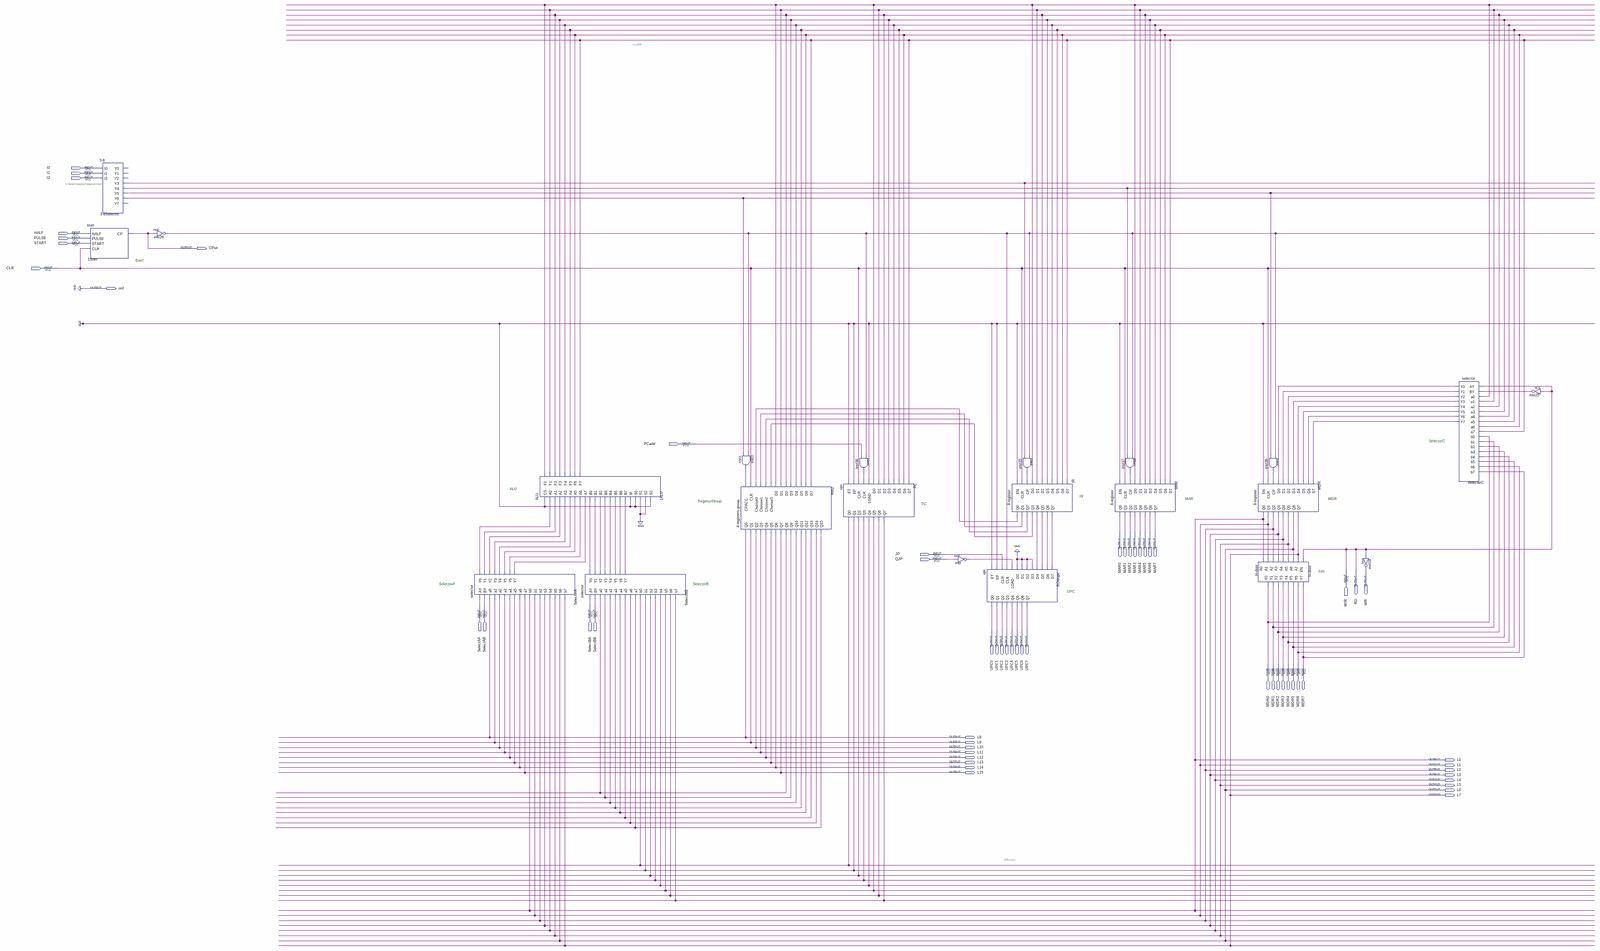
[diagram p0: schematic sheet, whole]
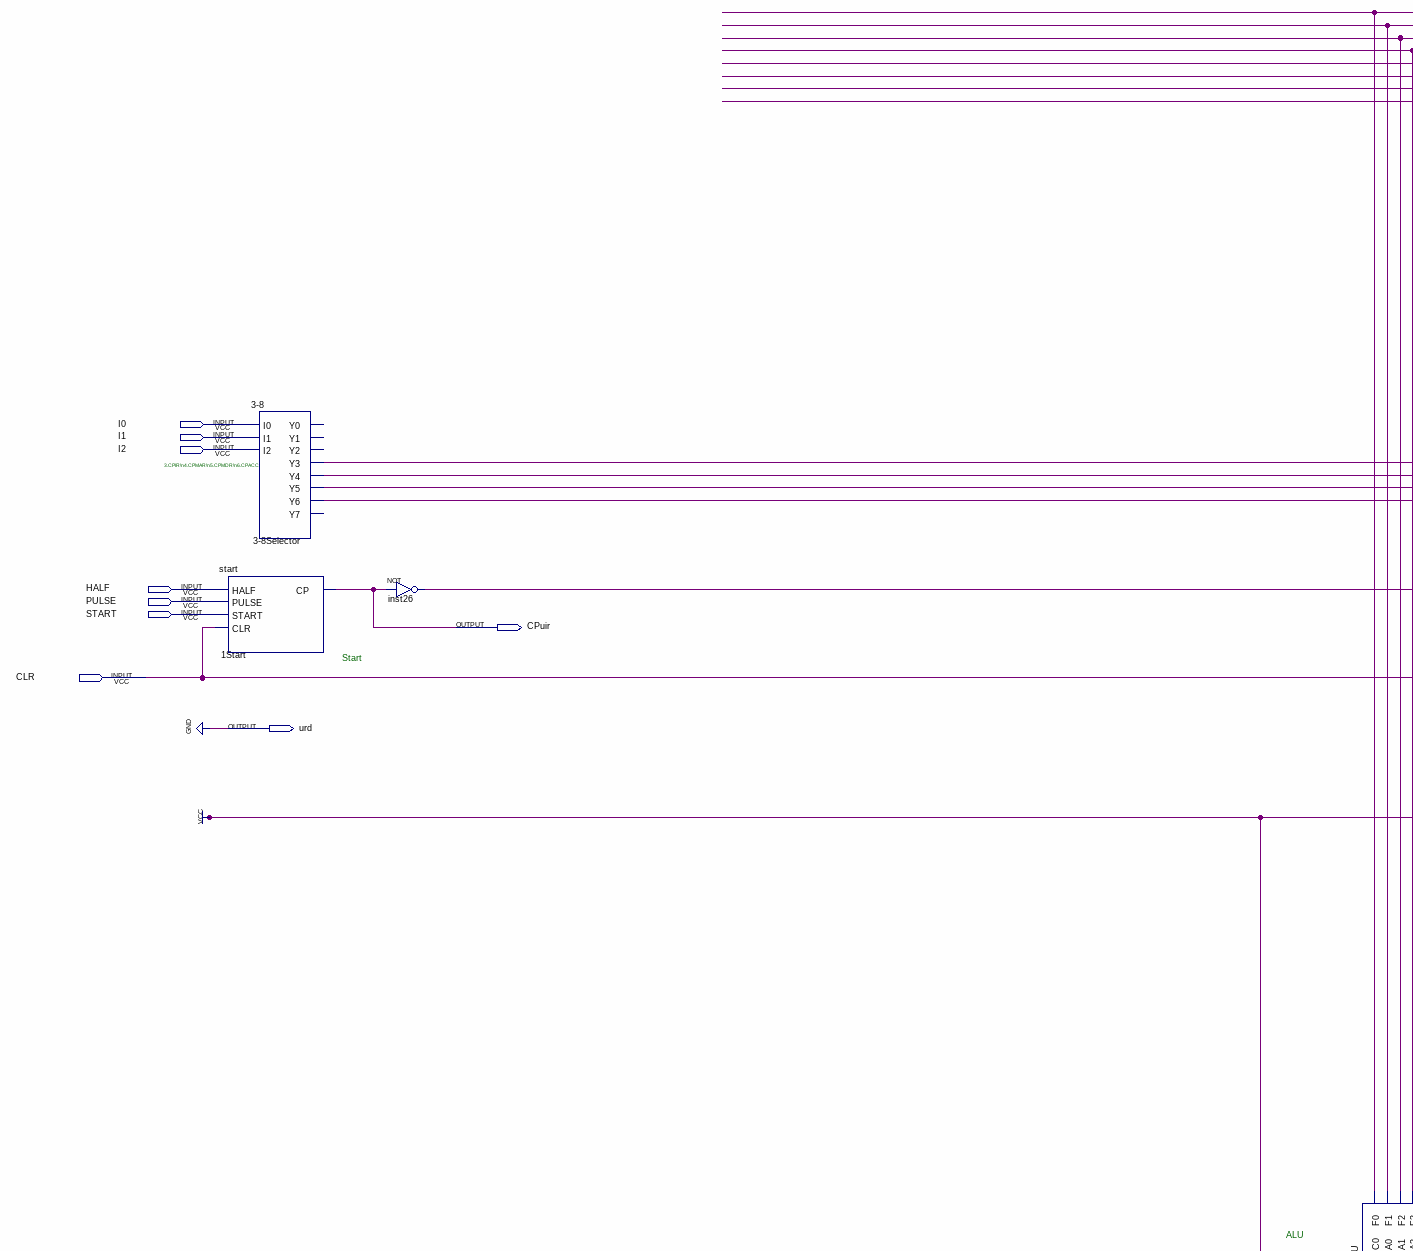
[diagram p1: schematic sheet, upper left part]
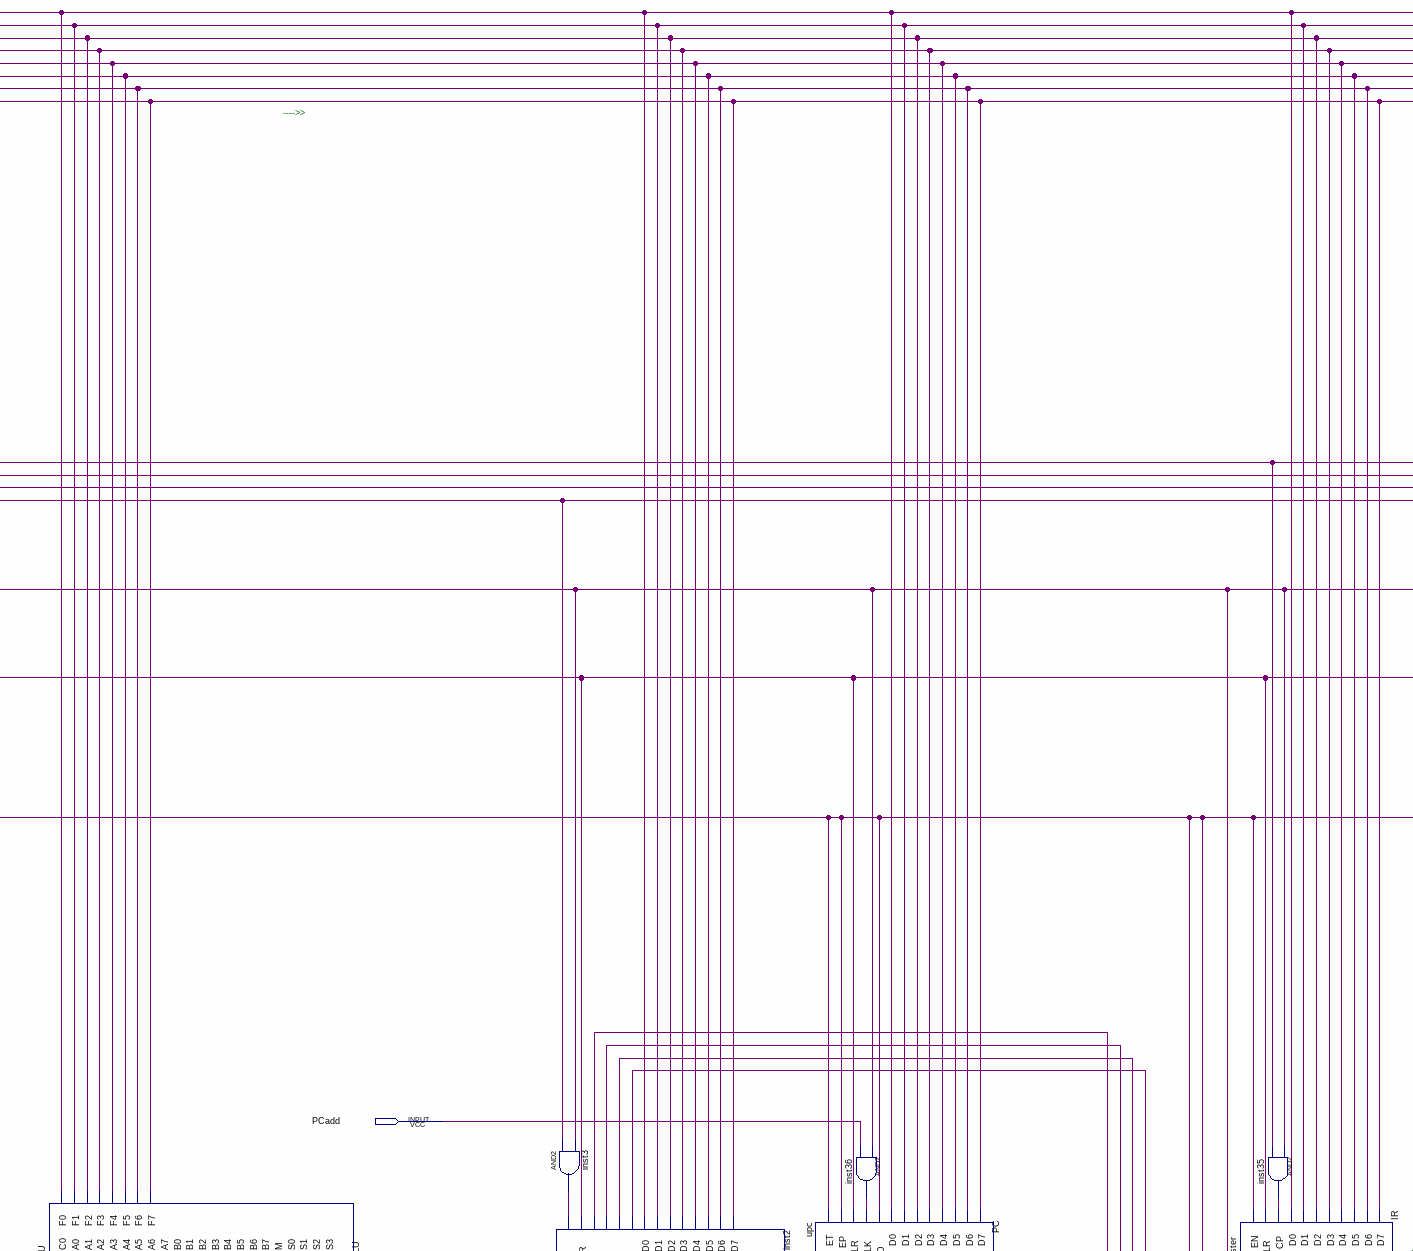
[diagram p2: schematic sheet, upper centre part]
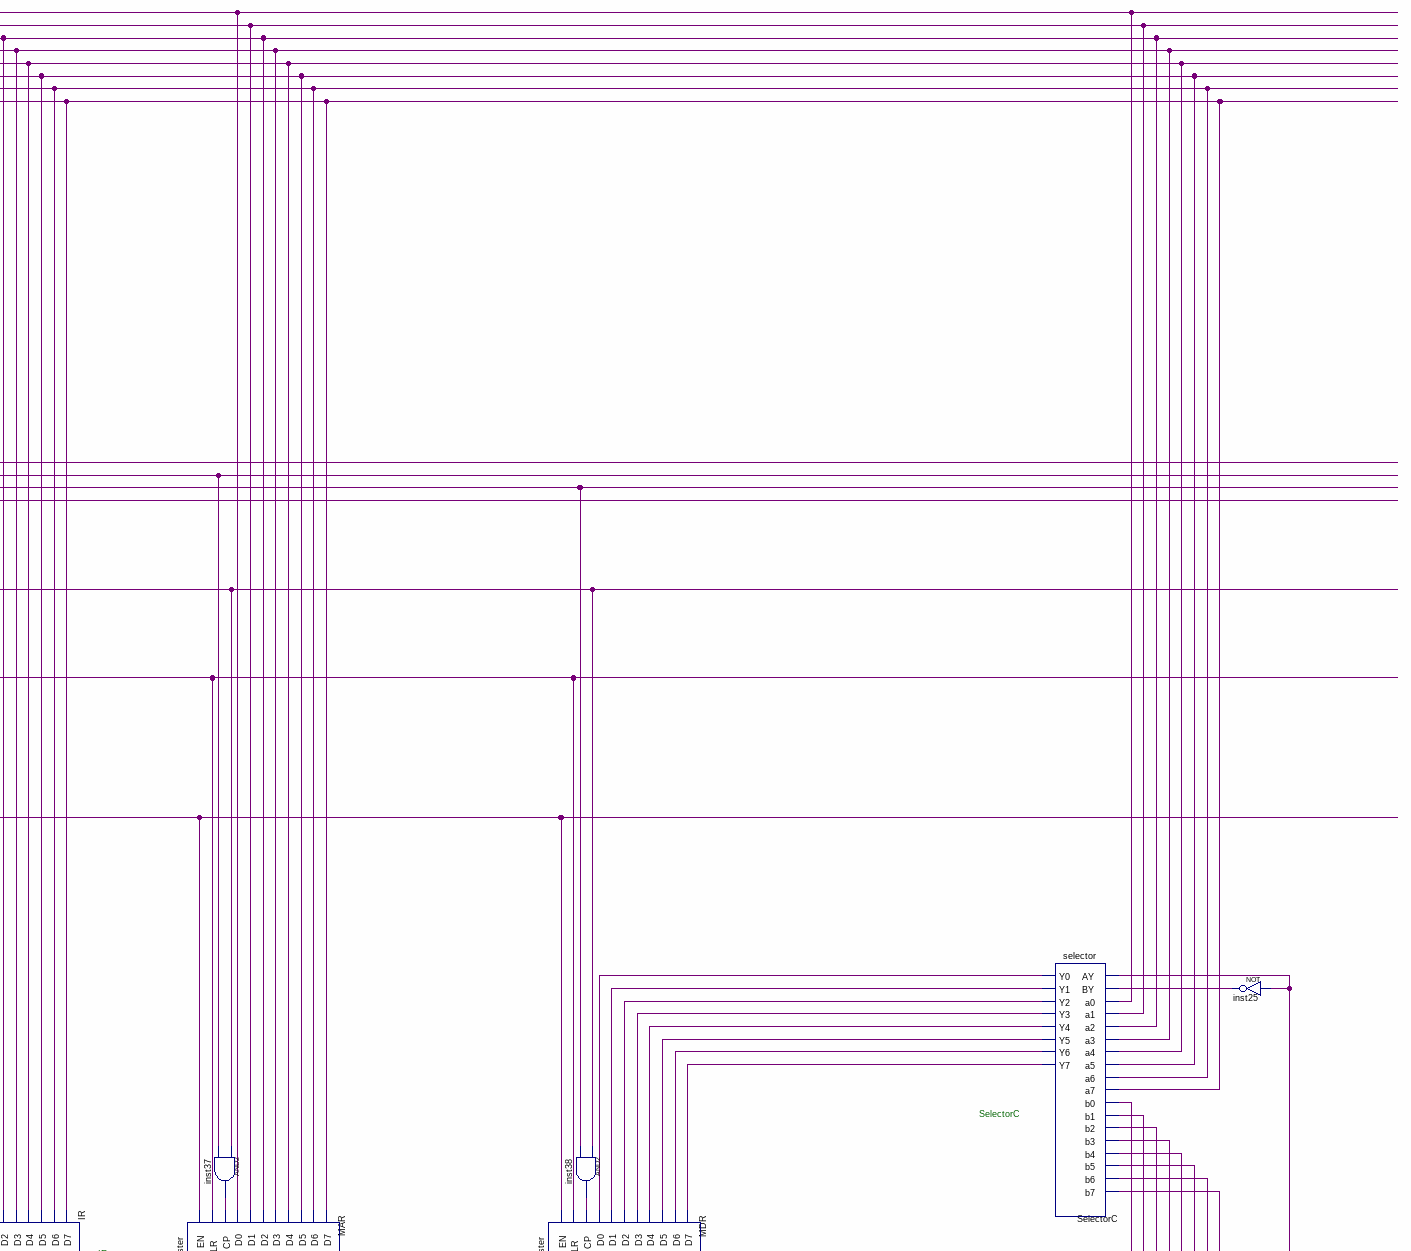
[diagram p3: schematic sheet, upper right part]
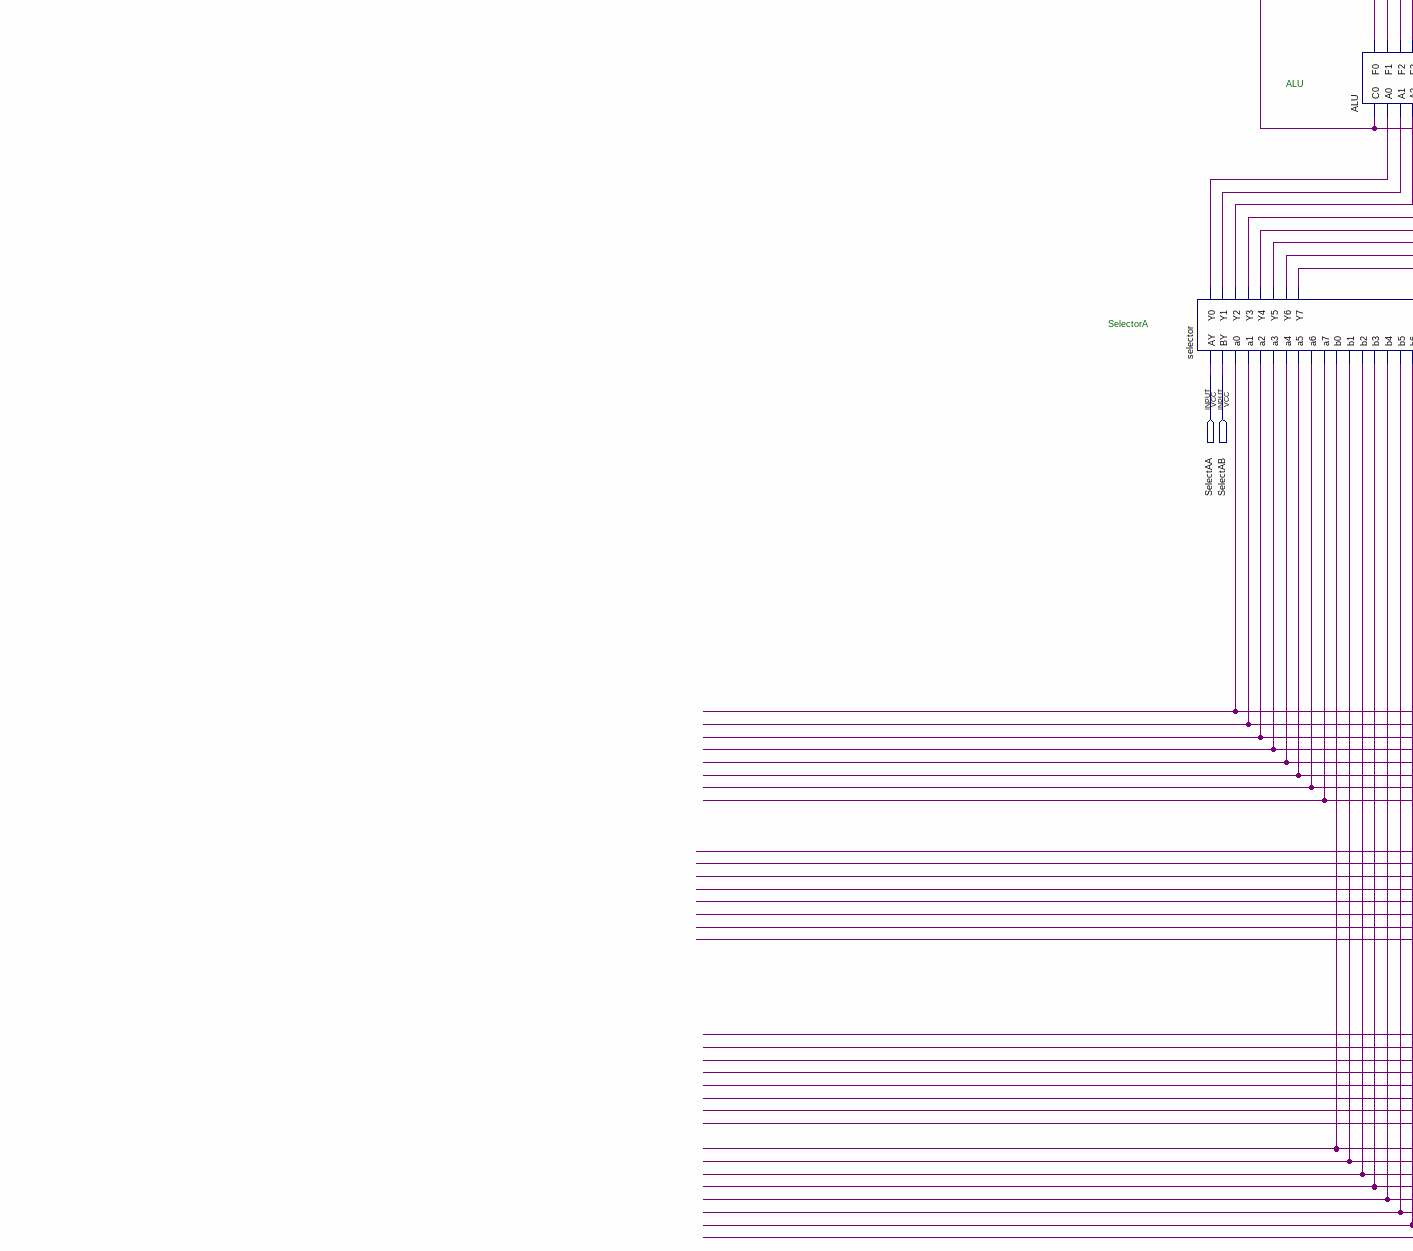
[diagram p4: schematic sheet, lower left part]
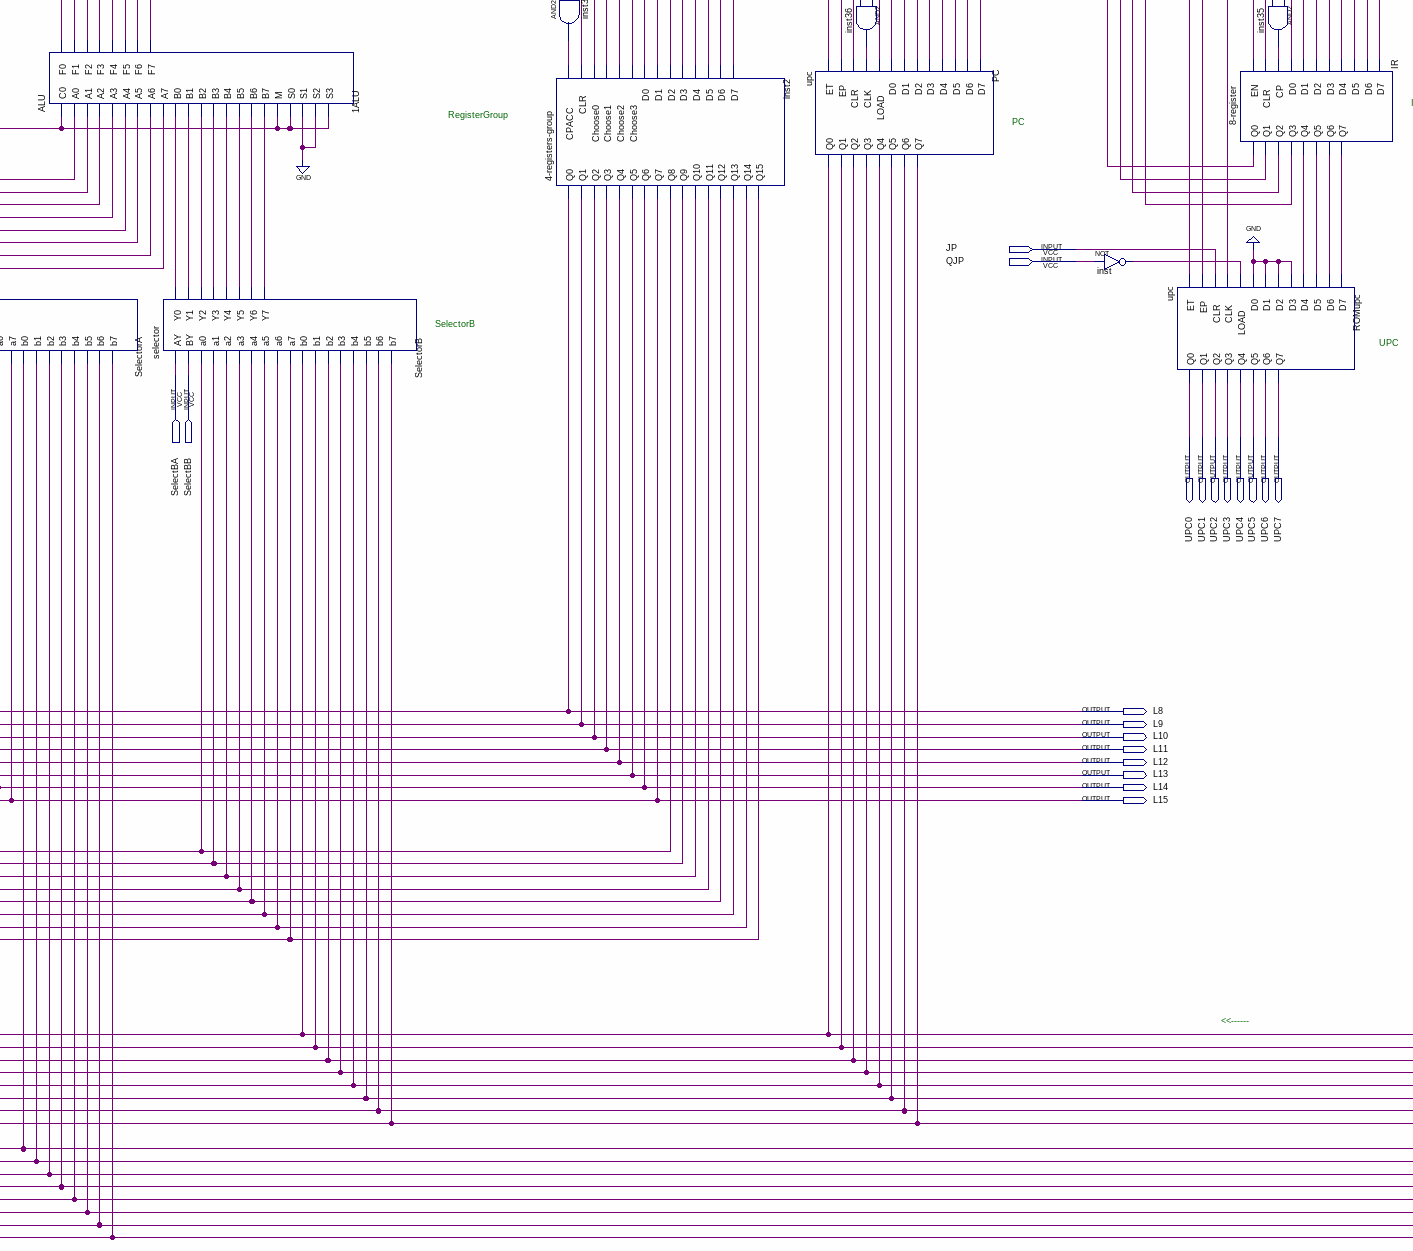
[diagram p5: schematic sheet, lower centre part]
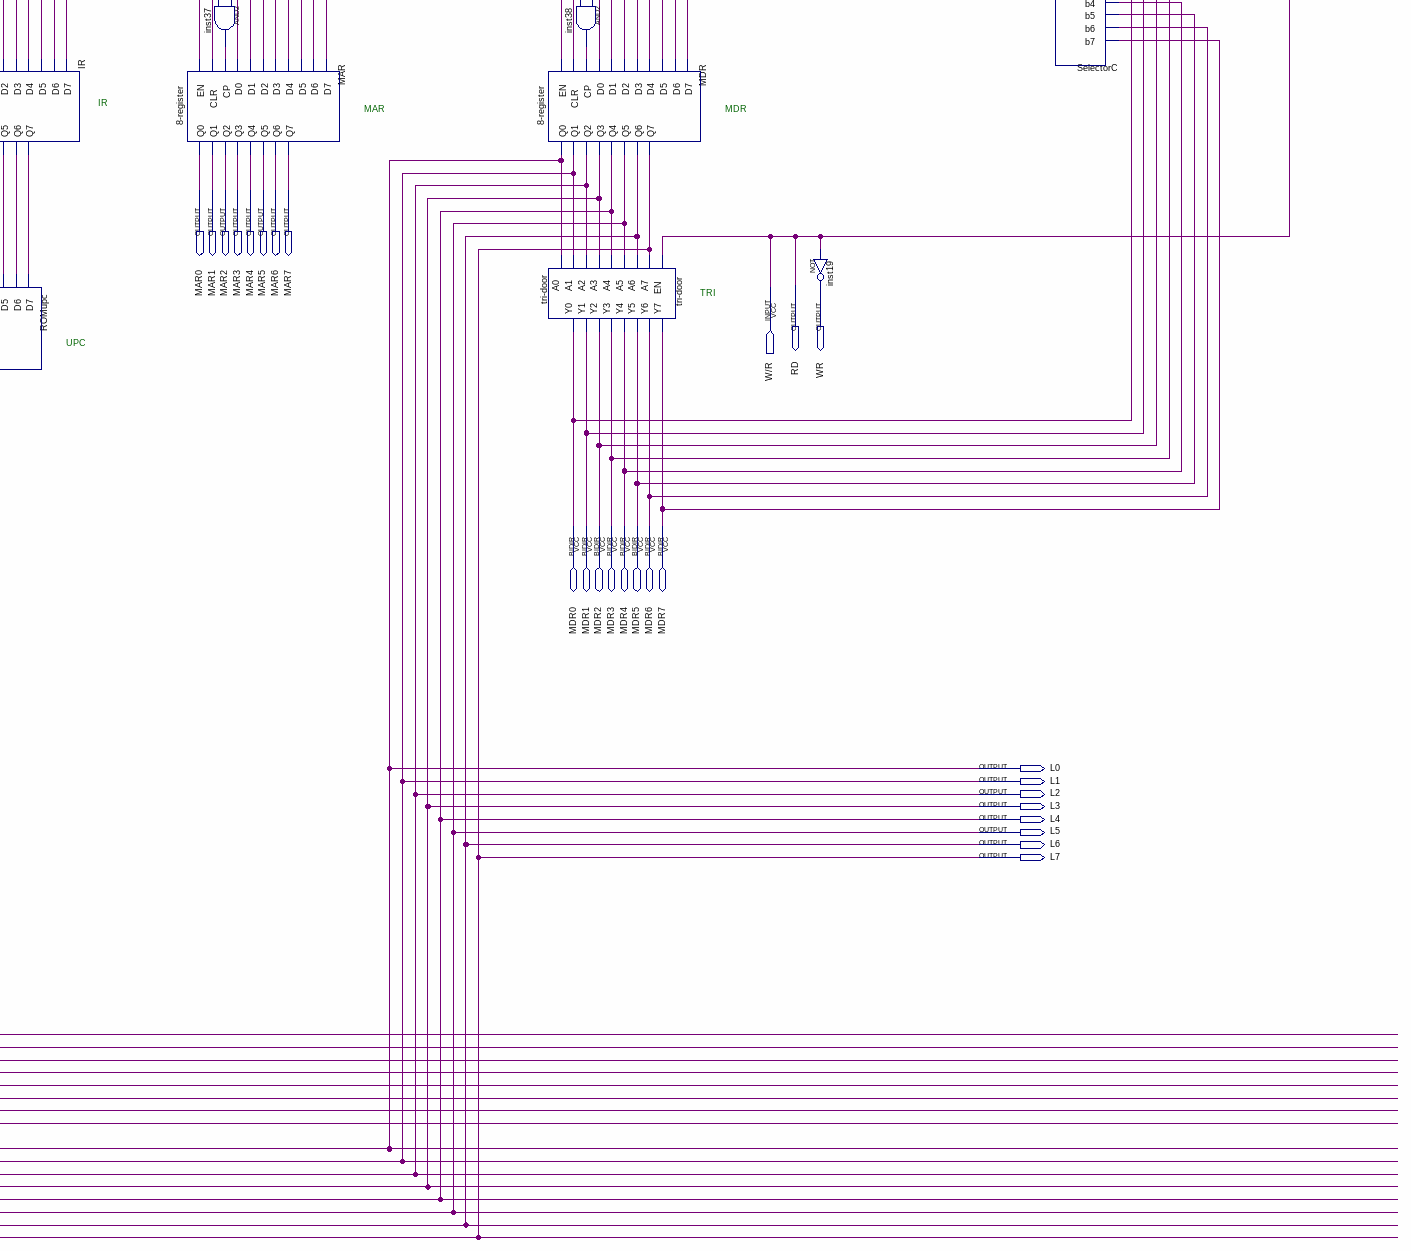
[diagram p6: schematic sheet, lower right part]
// Quartus schematic computer.bdf as structural Verilog: 22 symbols, 59 pins
module computer (
  input  I0,
  input  I1,
  input  I2,
  input  HALF,
  input  PULSE,
  input  START,
  input  CLR,
  input  PCadd,
  input  JP,
  input  QJP,
  input  \W/R ,
  input  SelectAA,
  input  SelectAB,
  input  SelectBA,
  input  SelectBB,
  inout  MDR0,
  inout  MDR1,
  inout  MDR2,
  inout  MDR3,
  inout  MDR4,
  inout  MDR5,
  inout  MDR6,
  inout  MDR7,
  output CPuir,
  output urd,
  output MAR0,
  output MAR1,
  output MAR2,
  output MAR3,
  output MAR4,
  output MAR5,
  output MAR6,
  output MAR7,
  output RD,
  output WR,
  output UPC0,
  output UPC1,
  output UPC2,
  output UPC3,
  output UPC4,
  output UPC5,
  output UPC6,
  output UPC7,
  output L8,
  output L9,
  output L10,
  output L11,
  output L12,
  output L0,
  output L13,
  output L1,
  output L14,
  output L2,
  output L15,
  output L3,
  output L4,
  output L5,
  output L6,
  output L7
);

  wire inst2_q8, inst2_q9, inst2_q10, inst2_q11, inst2_q12, inst2_q13, inst2_q14, inst2_q15, inst3_out,
       inst25_out, inst26_out, inst35_out, inst36_out, inst37_out, inst38_out, inst_out, IR_q0, IR_q1, IR_q2,
       IR_q3, IR_q4, IR_q5, IR_q6, IR_q7, n1ALU_f0, n1ALU_f1, n1ALU_f2, n1ALU_f3, n1ALU_f4, n1ALU_f5,
       n1ALU_f6, n1ALU_f7, n3_8Selector_y3, n3_8Selector_y4, n3_8Selector_y5, n3_8Selector_y6, PC_q0, PC_q1,
       PC_q2, PC_q3, PC_q4, PC_q5, PC_q6, PC_q7, SelectorA_y0, SelectorA_y1, SelectorA_y2, SelectorA_y3,
       SelectorA_y4, SelectorA_y5, SelectorA_y6, SelectorA_y7, SelectorB_y0, SelectorB_y1, SelectorB_y2,
       SelectorB_y3, SelectorB_y4, SelectorB_y5, SelectorB_y6, SelectorB_y7, SelectorC_y0, SelectorC_y1,
       SelectorC_y2, SelectorC_y3, SelectorC_y4, SelectorC_y5, SelectorC_y6, SelectorC_y7;

  start u_1Start (.HALF(HALF), .PULSE(PULSE), .START(START), .CLR(CLR), .CP(CPuir));
  \3-8  \u_3-8Selector  (
    .I0(I0), .I1(I1), .I2(I2), .Y3(n3_8Selector_y3), .Y4(n3_8Selector_y4), .Y5(n3_8Selector_y5),
    .Y6(n3_8Selector_y6));  // open: Y0, Y1, Y2, Y7
  not inst26 (inst26_out, CPuir);
  selector SelectorA (
    .AY(SelectAA), .BY(SelectAB), .a0(L8), .a1(L9), .a2(L10), .a3(L11), .a4(L12), .a5(L13), .a6(L14),
    .a7(L15), .b0(L0), .b1(L1), .b2(L2), .b3(L3), .b4(L4), .b5(L5), .b6(L6), .b7(L7), .Y0(SelectorA_y0),
    .Y1(SelectorA_y1), .Y2(SelectorA_y2), .Y3(SelectorA_y3), .Y4(SelectorA_y4), .Y5(SelectorA_y5),
    .Y6(SelectorA_y6), .Y7(SelectorA_y7));
  ALU u_1ALU (
    .C0(1'b1), .A0(SelectorA_y0), .A1(SelectorA_y1), .A2(SelectorA_y2), .A3(SelectorA_y3), .A4(SelectorA_y4),
    .A5(SelectorA_y5), .A6(SelectorA_y6), .A7(SelectorA_y7), .B0(SelectorB_y0), .B1(SelectorB_y1),
    .B2(SelectorB_y2), .B3(SelectorB_y3), .B4(SelectorB_y4), .B5(SelectorB_y5), .B6(SelectorB_y6),
    .B7(SelectorB_y7), .M(1'b1), .S0(1'b1), .S1(1'b0), .S2(1'b0), .S3(1'b1), .F0(n1ALU_f0), .F1(n1ALU_f1),
    .F2(n1ALU_f2), .F3(n1ALU_f3), .F4(n1ALU_f4), .F5(n1ALU_f5), .F6(n1ALU_f6), .F7(n1ALU_f7));
  selector SelectorB (
    .AY(SelectBA), .BY(SelectBB), .a0(inst2_q8), .a1(inst2_q9), .a2(inst2_q10), .a3(inst2_q11),
    .a4(inst2_q12), .a5(inst2_q13), .a6(inst2_q14), .a7(inst2_q15), .b0(PC_q0), .b1(PC_q1), .b2(PC_q2),
    .b3(PC_q3), .b4(PC_q4), .b5(PC_q5), .b6(PC_q6), .b7(PC_q7), .Y0(SelectorB_y0), .Y1(SelectorB_y1),
    .Y2(SelectorB_y2), .Y3(SelectorB_y3), .Y4(SelectorB_y4), .Y5(SelectorB_y5), .Y6(SelectorB_y6),
    .Y7(SelectorB_y7));
  and inst3 (inst3_out, n3_8Selector_y6, inst26_out);
  \4-registers-group  inst2 (
    .CPACC(inst3_out), .CLR(CLR), .Choose0(IR_q0), .Choose1(IR_q1), .Choose2(IR_q2), .Choose3(IR_q3),
    .D0(n1ALU_f0), .D1(n1ALU_f1), .D2(n1ALU_f2), .D3(n1ALU_f3), .D4(n1ALU_f4), .D5(n1ALU_f5), .D6(n1ALU_f6),
    .D7(n1ALU_f7), .Q0(L8), .Q1(L9), .Q2(L10), .Q3(L11), .Q4(L12), .Q5(L13), .Q6(L14), .Q7(L15),
    .Q8(inst2_q8), .Q9(inst2_q9), .Q10(inst2_q10), .Q11(inst2_q11), .Q12(inst2_q12), .Q13(inst2_q13),
    .Q14(inst2_q14), .Q15(inst2_q15));
  upc PC (
    .ET(1'b1), .EP(1'b1), .CLR(CLR), .CLK(inst36_out), .LOAD(1'b1), .D0(n1ALU_f0), .D1(n1ALU_f1),
    .D2(n1ALU_f2), .D3(n1ALU_f3), .D4(n1ALU_f4), .D5(n1ALU_f5), .D6(n1ALU_f6), .D7(n1ALU_f7), .Q0(PC_q0),
    .Q1(PC_q1), .Q2(PC_q2), .Q3(PC_q3), .Q4(PC_q4), .Q5(PC_q5), .Q6(PC_q6), .Q7(PC_q7));
  and inst36 (inst36_out, inst26_out, PCadd);
  not inst (inst_out, QJP);
  upc ROMupc (
    .ET(1'b1), .EP(1'b1), .CLR(JP), .CLK(inst26_out), .LOAD(inst_out), .D0(1'b0), .D1(1'b0), .D2(1'b0),
    .D3(1'b0), .D4(IR_q4), .D5(IR_q5), .D6(IR_q6), .D7(IR_q7), .Q0(UPC0), .Q1(UPC1), .Q2(UPC2), .Q3(UPC3),
    .Q4(UPC4), .Q5(UPC5), .Q6(UPC6), .Q7(UPC7));
  \8-register  IR (
    .EN(1'b1), .CLR(CLR), .CP(inst35_out), .D0(n1ALU_f0), .D1(n1ALU_f1), .D2(n1ALU_f2), .D3(n1ALU_f3),
    .D4(n1ALU_f4), .D5(n1ALU_f5), .D6(n1ALU_f6), .D7(n1ALU_f7), .Q0(IR_q0), .Q1(IR_q1), .Q2(IR_q2),
    .Q3(IR_q3), .Q4(IR_q4), .Q5(IR_q5), .Q6(IR_q6), .Q7(IR_q7));
  and inst35 (inst35_out, inst26_out, n3_8Selector_y3);
  \8-register  MAR (
    .EN(1'b1), .CLR(CLR), .CP(inst37_out), .D0(n1ALU_f0), .D1(n1ALU_f1), .D2(n1ALU_f2), .D3(n1ALU_f3),
    .D4(n1ALU_f4), .D5(n1ALU_f5), .D6(n1ALU_f6), .D7(n1ALU_f7), .Q0(MAR0), .Q1(MAR1), .Q2(MAR2), .Q3(MAR3),
    .Q4(MAR4), .Q5(MAR5), .Q6(MAR6), .Q7(MAR7));
  and inst37 (inst37_out, inst26_out, n3_8Selector_y4);
  and inst38 (inst38_out, inst26_out, n3_8Selector_y5);
  \8-register  MDR (
    .EN(1'b1), .CLR(CLR), .CP(inst38_out), .D0(SelectorC_y0), .D1(SelectorC_y1), .D2(SelectorC_y2),
    .D3(SelectorC_y3), .D4(SelectorC_y4), .D5(SelectorC_y5), .D6(SelectorC_y6), .D7(SelectorC_y7), .Q0(L0),
    .Q1(L1), .Q2(L2), .Q3(L3), .Q4(L4), .Q5(L5), .Q6(L6), .Q7(L7));
  \tri-door  \tri-door  (
    .EN(\W/R ), .A7(L7), .A6(L6), .A5(L5), .A4(L4), .A3(L3), .A2(L2), .A1(L1), .A0(L0), .Y7(MDR7), .Y6(MDR6),
    .Y5(MDR5), .Y4(MDR4), .Y3(MDR3), .Y2(MDR2), .Y1(MDR1), .Y0(MDR0));
  not inst19 (WR, \W/R );
  selector SelectorC (
    .AY(\W/R ), .BY(inst25_out), .a0(n1ALU_f0), .a1(n1ALU_f1), .a2(n1ALU_f2), .a3(n1ALU_f3), .a4(n1ALU_f4),
    .a5(n1ALU_f5), .a6(n1ALU_f6), .a7(n1ALU_f7), .b0(MDR0), .b1(MDR1), .b2(MDR2), .b3(MDR3), .b4(MDR4),
    .b5(MDR5), .b6(MDR6), .b7(MDR7), .Y0(SelectorC_y0), .Y1(SelectorC_y1), .Y2(SelectorC_y2),
    .Y3(SelectorC_y3), .Y4(SelectorC_y4), .Y5(SelectorC_y5), .Y6(SelectorC_y6), .Y7(SelectorC_y7));
  not inst25 (inst25_out, \W/R );

  assign RD = \W/R ;
  assign urd = 1'b0;

  // Notes on the sheet:
  //   ---->>
  //   3.CPIR\n4.CPMAR\n5.CPMDR\n6.CPACC
  //   Start
  //   SelectorC
  //   ALU
  //   IR
  //   MAR
  //   MDR
  //   RegisterGroup
  //   PC
  //   TRI
  //   SelectorA
  //   SelectorB
  //   UPC
  //   <<------
endmodule
